# EAGLE schematic untitled 2 (EAGLE 7.5.0)
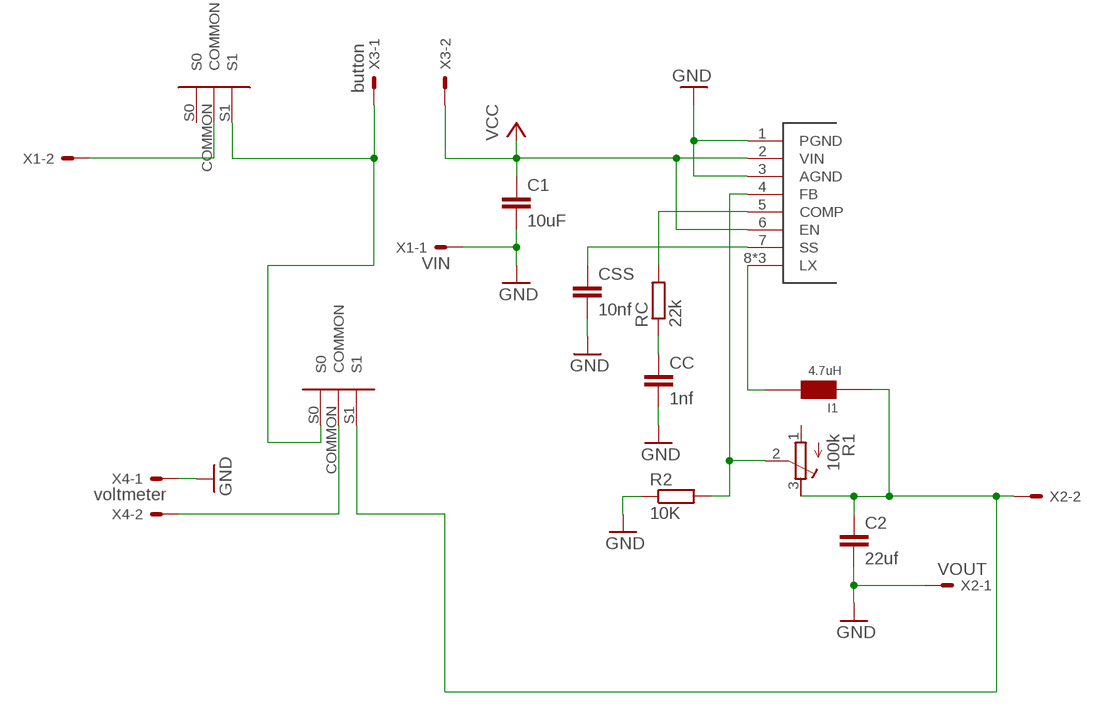
[diagram p0: schematic, sheet 1]

## Parts
C1  10uF  C-EUC0805K  [C0805K]
C2  22uf  C-EUC0805K  [C0805K]
CC  1nf  C-EUC1206K  [C1206K]
CSS  10nf  C-EUC1206K  [C1206K]
I1  4.7uH  RH127  [RH127]
MASTER_ON  SPDT_SLIDE_SWITCH_2_PITCH  [SPDT_SLIDE_SWITCH_2_PITCH]
METER_SWITCH  SPDT_SLIDE_SWITCH_2_PITCH  [SPDT_SLIDE_SWITCH_2_PITCH]
R1  100k  R-TRIMM64W  [RTRIM64W]
R2  10K  R-EU_R1206  [R1206]
RC  22k  R-EU_R1206  [R1206]
U$3  AOZ1051PI  [AOZ1051PI]
X1  VIN  XH2.54  [XH2.54]
X2  VOUT  XH2.54  [XH2.54]
X3  button  XH2.54  [XH2.54]
X4  voltmeter  XH2.54  [XH2.54]

## Nets
GND: C1.2 C2.2 CC.2 CSS.2 R2.1 U$3.1(PGND) U$3.3(AGND) X1.1 X2.1 X4.1
N$1: RC.2 U$3.5(COMP)
N$2: CC.1 RC.1
N$3: R1.2(S) R2.2 U$3.4(FB)
N$4: CSS.1 U$3.7(SS)
N$5: METER_SWITCH.COMMON X4.2
N$6: I1.P$1 U$3.8(LX) U$3.P$1(LX) U$3.P$2(LX)
N$7: C2.1 I1.P$2 METER_SWITCH.S1 R1.3(E) X2.2
N$8: MASTER_ON.COMMON X1.2
N$10: MASTER_ON.S1 METER_SWITCH.S0 X3.1
VCC: C1.1 U$3.2(VIN) U$3.6(EN) X3.2
Unconnected: MASTER_ON.S0 R1.1(A)

## Library data of the parts
C1 C2 CC CSS = resistor:C-EU: CAPACITOR, European symbol
I1 = sh4dov lib:RH127
MASTER_ON METER_SWITCH = sh4dov lib:SPDT_SLIDE_SWITCH_2_PITCH
R1 = resistor:R-TRIMM: Trimm resistor
R2 RC = resistor:R-EU_: RESISTOR, European symbol
U$3 = sh4dov lib:AOZ1051PI
X1-X4 = sh4dov lib:XH2.54: .100" (2.54mm) Center Header - 2 Pin; MF: MOLEX; MPN: 22-23-2021; OC_FARNELL: 1462926; OC_NEWARK: 25C3832